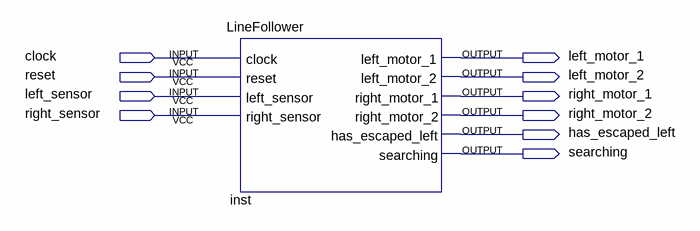
[diagram p0: schematic sheet]
// Quartus schematic LineFollowerDiagram.bdf as structural Verilog: 1 symbols, 10 pins
module LineFollowerDiagram (
  input  clock,
  input  reset,
  input  left_sensor,
  input  right_sensor,
  output left_motor_1,
  output left_motor_2,
  output right_motor_1,
  output right_motor_2,
  output has_escaped_left,
  output searching
);

  LineFollower inst (
    .clock(clock), .reset(reset), .left_sensor(left_sensor), .right_sensor(right_sensor),
    .left_motor_1(left_motor_1), .left_motor_2(left_motor_2), .right_motor_1(right_motor_1),
    .right_motor_2(right_motor_2), .has_escaped_left(has_escaped_left), .searching(searching));
endmodule
